# EAGLE design fonte (EAGLE 9.6.2)
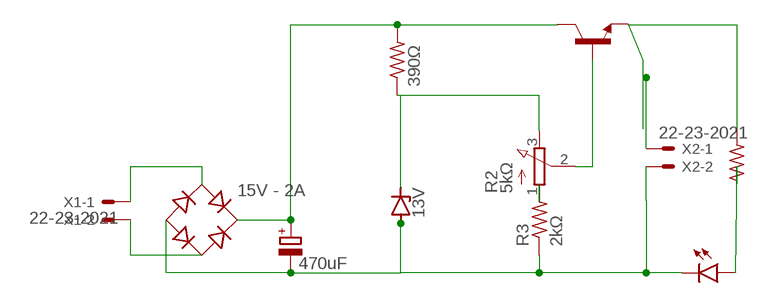
[diagram p0: schematic, sheet 1]

## Parts
B1  15V - 2A  RB1A  [RB1A]
C1  470uF  CPOL-EUE3.5-10  [E3,5-10]
D1  13V  ZENER-DIODEDO41Z10  [DO41Z10]
LED1  LED5MM  [LED5MM]
Q1  BC547B  [TO92]
R1  390Ω  R-US_0309/12  [0309/12]
R2  5kΩ  3RP/1610N  [3RP/1610N]
R3  2kΩ  R-US_0309/12  [0309/12]
R5  R-US_0309/12  [0309/12]
X1  22-23-2021  [22-23-2021]
X2  22-23-2021  [22-23-2021]

## Nets
N$1: R2.1(A) R3.2
N$2: Q1.1(E) R5.2 X2.1
N$4: B1.AC2 X1.1
N$5: B1.AC1 X1.2
N$6: B1.- C1.- D1.A LED1.K(C) R3.1 X2.2
N$7: B1.+ C1.+ Q1.3(C) R1.2
N$9: R1.1 R2.3(E)
N$10: LED1.A R5.1
N$12: Q1.2(B) R2.2(S)
N$14: D1.C

## Library data of the parts
B1 = rectifier:RB1A: RECTIFIER 1 A
C1 = rcl:CPOL-EU: POLARIZED CAPACITOR, European symbol; SPICEPREFIX: C
D1 = diode:ZENER-DIODE: Z-Diode
LED1 = led:LED: LED OSRAM: - CHIPLED LG R971, LG N971, LY N971, LG Q971, LY Q971, LO R971, LY R971 LH N974, LH R974 LS Q976, LO Q976, LY Q976 LO Q996 - Hyper CHIPLED LW Q18S LB Q993, LB Q99A, LB R99A - SideLED LS A670, LO A670, LY A670, LG A670, LP A670 LB A673, LV A673, LT A673, LW A673 LH A674 LY A675 LS A676, LA A676, LO A676, LY A676, LW A676 LS A679, LY A679, LG A679 - Hyper Micro SIDELED® LS Y876, LA Y876, LO Y876, LY Y876 LT Y87S - SmartLED LW L88C, LW L88S LB L89C, LB L89S, LG L890 LS L89K, LO L89K, LY L89K LS L896, LA L896, LO L896, LY L896 - TOPLED LS T670, LO T670, LY T670, LG T670, LP T670 LSG T670, LSP T670, LSY T670, LOP T670, LYG T670 LG T671, LOG T671, LSG T671 LB T673, LV T673, LT T673, LW T673 LH T674 LS T676, LA T676, LO T676, LY T676, LB T676, LH T676, LSB T676, LW T676 LB T67C, LV T67C, LT T67C, LS T67K, LO T67K, LY T67K, LW E67C LS E67B, LA E67B, LO E67B, LY E67B, LB E67C, LV E67C, LT E67C LW T67C LS T679, LY T679, LG T679 LS T770, LO T770, LY T770, LG T770, LP T770 LB T773, LV T773, LT T773, LW T773 LH T774 LS E675, LA E675, LY E675, LS T675 LS T776, LA T776, LO T776, LY T776, LB T776 LHGB T686 LT T68C, LB T68C - Hyper Mini TOPLED® LB M676 - Mini TOPLED Santana® LG M470 LS M47K, LO M47K, LY M47K Source: http://www.osram.convergy.de LUXEON: - LUMILED® LXK2-PW12-R00, LXK2-PW12-S00, LXK2-PW14-U00, LXK2-PW14-V00 LXK2-PM12-R00, LXK2-PM12-S00, LXK2-PM14-U00 LXK2-PE12-Q00, LXK2-PE12-R00, LXK2-PE12-S00, LXK2-PE14-T00, LXK2-PE14-U00 LXK2-PB12-K00, LXK2-PB12-L00, LXK2-PB12-M00, LXK2-PB14-N00, LXK2-PB14-P00, LXK2-PB14-Q00 LXK2-PR12-L00, LXK2-PR12-M00, LXK2-PR14-Q00, LXK2-PR14-R00 LXK2-PD12-Q00, LXK2-PD12-R00, LXK2-PD12-S00 LXK2-PH12-R00, LXK2-PH12-S00 LXK2-PL12-P00, LXK2-PL12-Q00, LXK2-PL12-R00 Source: www.luxeon.com KINGBRIGHT: KA-3528ASYC Source: www.kingbright.com
Q1 = transistor-npn:BC547*: NPN Transistor
R1 R3 R5 = rcl:R-US_: RESISTOR, American symbol; SPICEPREFIX: R
R2 = pot:3RP/1610N: 16mm Potentiometer one level Source: http://www.alphapotentiometers.net/html/16mm_pot_2.html
X1 X2 = con-molex:22-23-2021: .100" (2.54mm) Center Header - 2 Pin; MF: MOLEX; MPN: 22-23-2021; OC_FARNELL: 1462926; OC_NEWARK: 25C3832

## Board
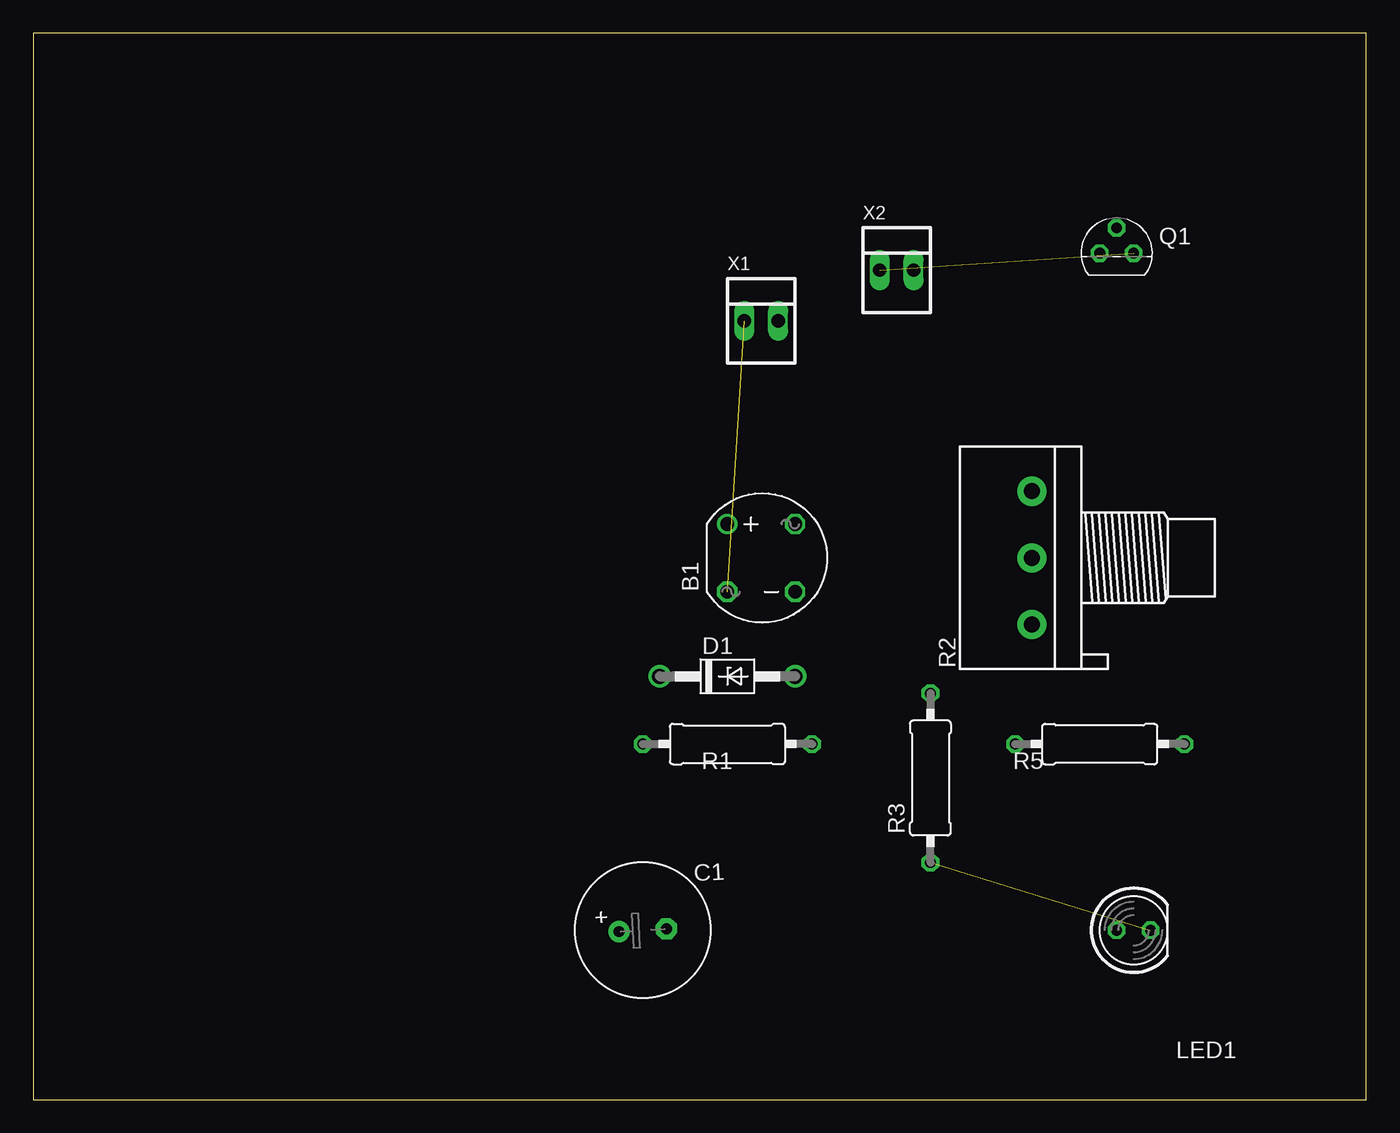
[diagram p1: board, top side]
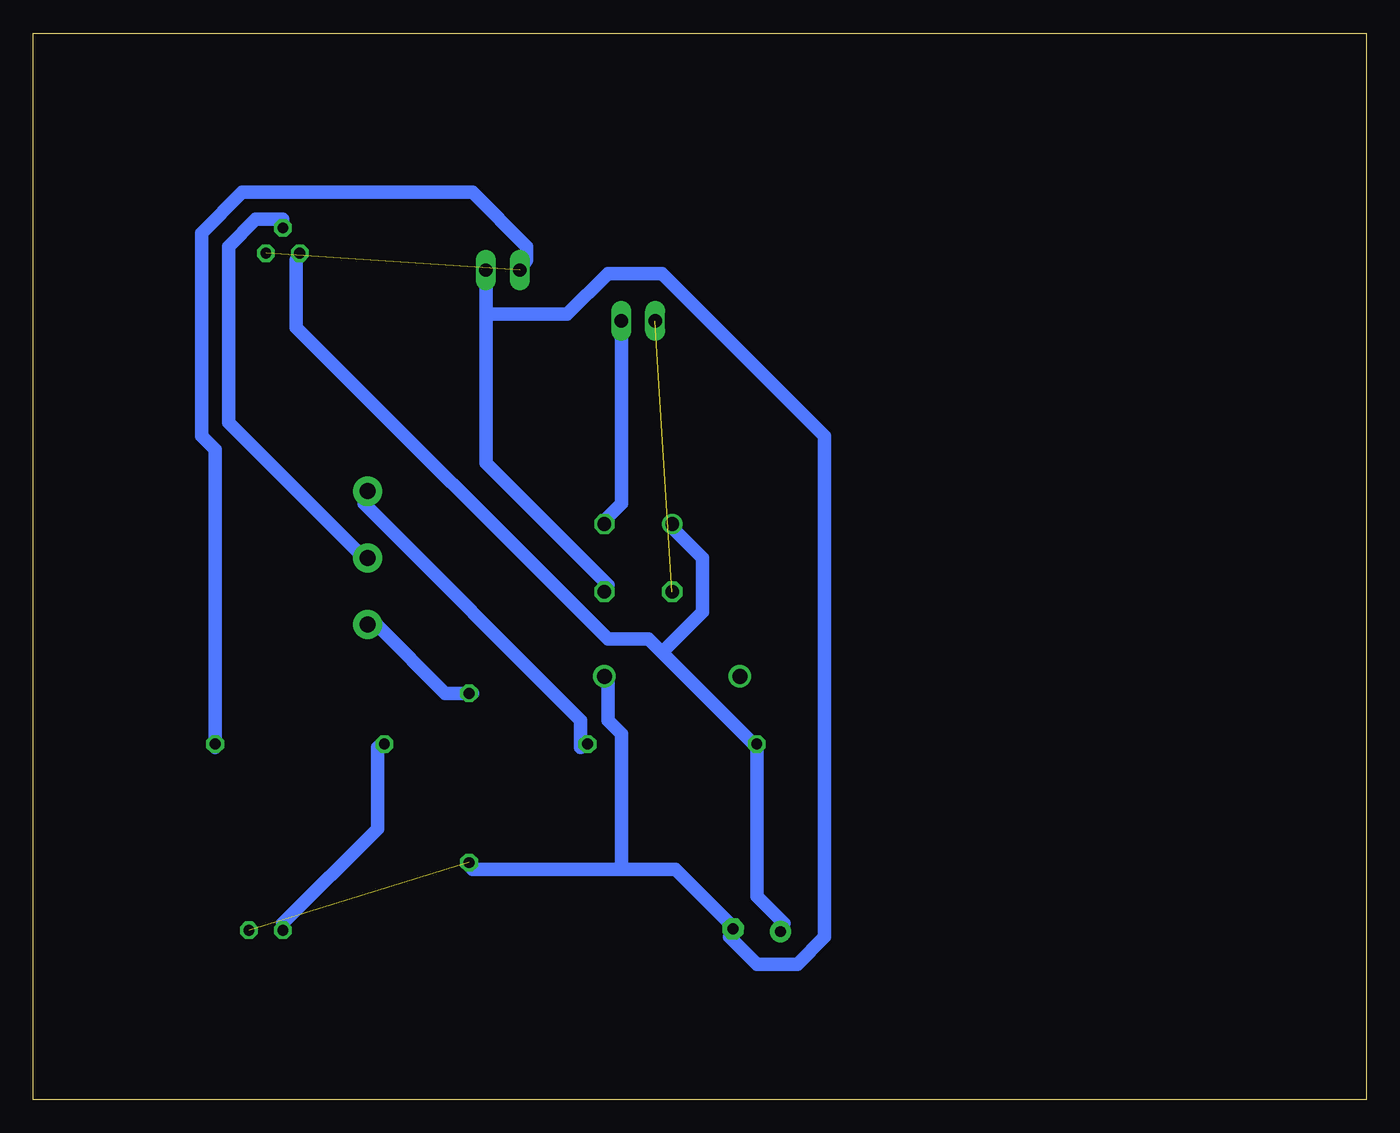
[diagram p2: board, bottom side, seen from below]

Size 100 x 80 mm. Coordinates in mm from the lower left corner, seen from the top.
Outline: 0,0 100,0 100,80 0,80 0,0
Copper layers (1*16): Top 0.035mm / dielectric 1.5mm / Bottom 0.035mm
Design rules "default *": minimum track width 40mil, minimum drill 0.35mm, track to track 40mil, track to pad 40mil, pad to pad 40mil, via to via 40mil, smd to smd 40mil, copper to edge 40mil, drill to drill 6mil, minimum pad ring 10mil, minimum via ring 8mil, stop-mask expansion 4mil, vias tented up to drill 0mil, thermal gap 10mil

### Footprints (pad centres in the part's own frame; a part is rotated, then mirrored left to right if it is on the bottom)
RB1A = drill 1.016: + -2.54,2.54 | drill 1.016 octagon: - 2.54,-2.54; AC1 2.54,2.54; AC2 -2.54,-2.54
E3,5-10 = drill 0.813 pad 1.6: + -1.778,0 | drill 0.813 pad 1.6 octagon: - 1.778,0
DO41Z10 = drill 1.118: A 5.08,0; C -5.08,0
LED5MM = drill 0.813 octagon: A -1.27,0; K 1.27,0
TO92 = drill 0.813 octagon: 1 1.27,0; 2 0,1.905; 3 -1.27,0
0309/12 = drill 0.813 octagon: 1 -6.35,0; 2 6.35,0
3RP/1610N = drill 1.2 pad 2.184: 1 -5,0; 2 0,0; 3 5,0
22-23-2021 = drill 1 long: 1 -1.27,0; 2 1.27,0

### Placement (x,y rotation side)
B1  54.61,40.64 0 top
C1  45.72,12.7 3.1 top
D1  52.07,31.75 0 top
LED1  82.55,12.7 0 top
Q1  81.28,63.5 0 top
R1  52.07,26.67 180 top
R2  74.93,40.64 90 top
R3  67.31,24.13 90 top
R5  80.01,26.67 0 top
X1  54.61,58.42 0 top
X2  64.77,62.23 0 top

### Tracks (layer width: path | path; a pad name or v marks a point on that pad's centre or on a via)
N$1
  Bottom 1.016: 67.06,30.48 R3.2 69.09,30.48 74.17,35.56 R2.1
N$2  (1 unrouted)
  Bottom 1.016: 86.36,26.42 R5.2 86.36,48.77 87.38,49.78 87.38,65.02 84.33,68.07 67.06,68.07 62.99,64.01 62.99,62.99 X2.1
N$4  (1 unrouted)
N$5
  Bottom 1.016: X1.2 55.88,44.7 56.9,43.69 B1.AC1
N$6  (1 unrouted)
  Bottom 1.016: 66.04,58.93 66.04,47.75 56.9,38.61 B1.- | 66.04,58.93 X2.2 | 55.88,17.27 51.82,17.27 47.75,13.21 C1.- 47.75,12.19 45.72,10.16 42.67,10.16 40.64,12.19 40.64,49.78 52.83,61.98 56.9,61.98 59.94,58.93 66.04,58.93 | 55.88,17.27 67.06,17.27 R3.1 | 55.88,17.27 55.88,27.43 56.9,28.45 56.9,31.5 D1.A
N$7
  Bottom 1.016: 45.72,26.42 45.72,15.24 43.69,13.21 C1.+ | 45.72,26.42 52.83,33.53 | 52.83,33.53 53.85,34.54 56.9,34.54 80.26,57.91 80.26,62.99 Q1.3 | 45.72,26.42 R1.2 | 52.83,33.53 49.78,36.58 49.78,40.64 51.82,42.67 B1.+
N$9
  Bottom 1.016: R1.1 58.93,26.42 58.93,28.45 75.18,44.7 R2.3
N$10
  Bottom 1.016: R5.1 74.17,26.42 74.17,20.32 81.28,13.21 LED1.A
N$12
  Bottom 1.016: Q1.2 81.28,66.04 83.31,66.04 85.34,64.01 85.34,50.8 75.18,40.64 R2.2